# EAGLE design led-er-v3-module-e (EAGLE 7.2.0)
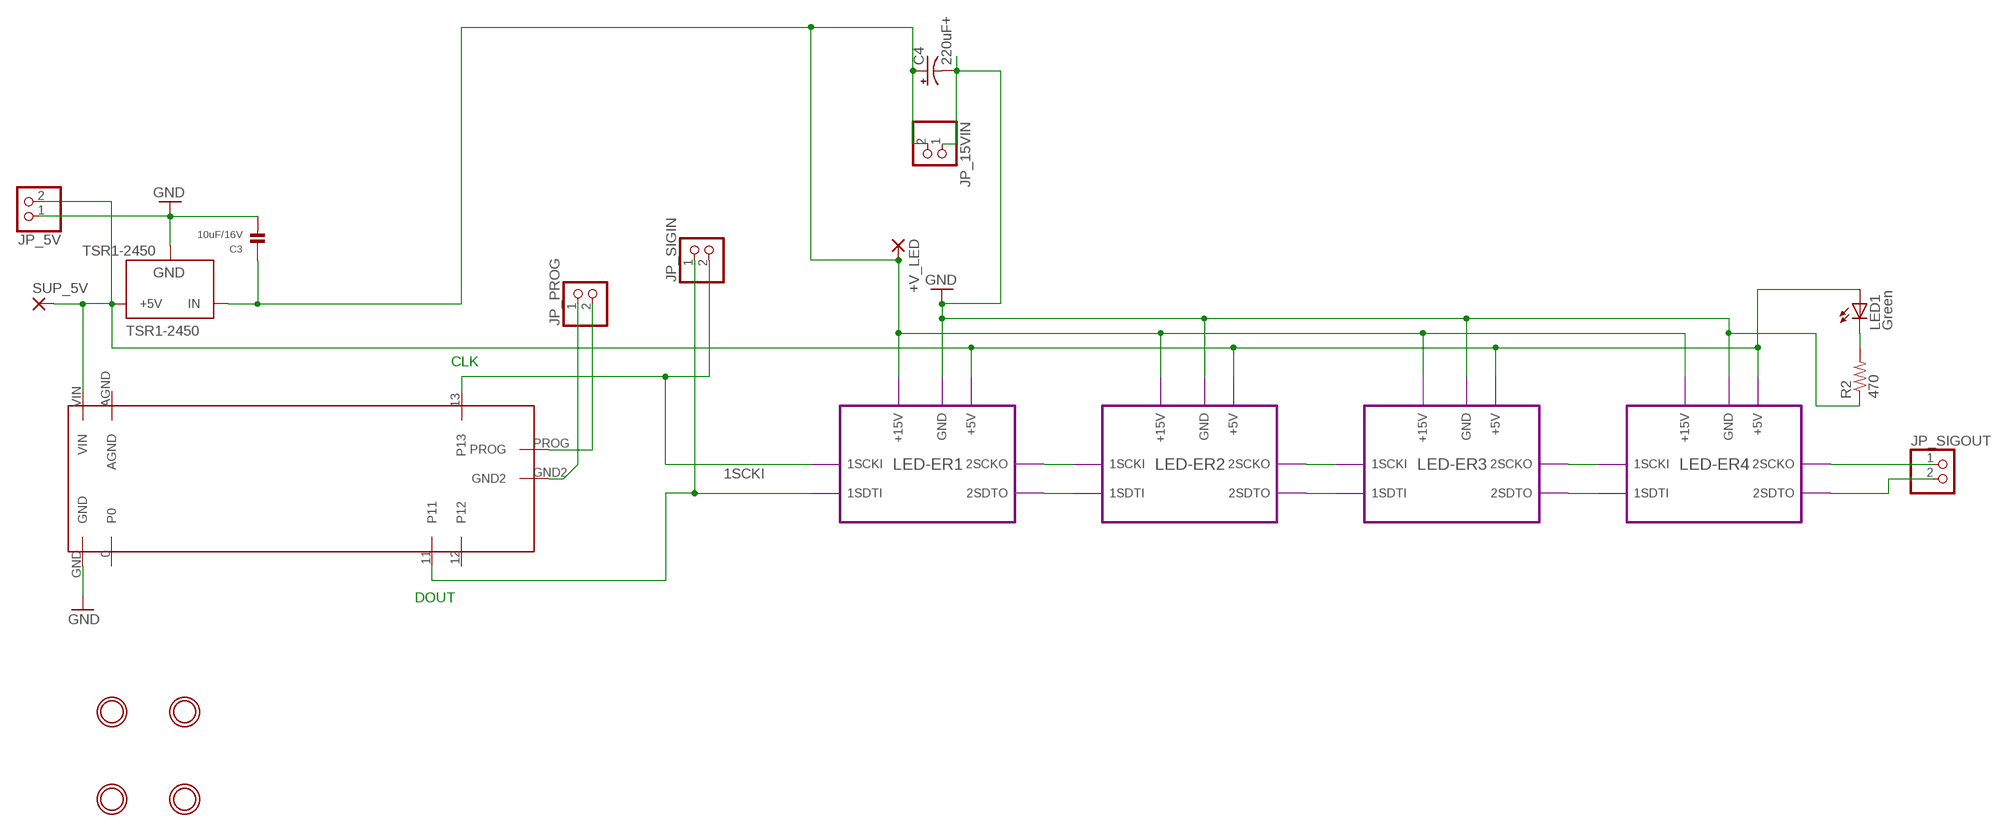
[diagram p0: schematic, sheet 1]

## Parts
+V_LED  3,17/1,1  [3,17/1,1]
C3  10uF/16V  CAP_CERAMIC0805  [0805]
C4  220uF+  CPOL-USE5-8.5  [E5-8,5]
JP_5V  HEADER-1X2  [1X02_OVAL]
JP_15VIN  HEADER-1X2  [1X02_OVAL]
JP_PROG  HEADER-1X2  [1X02_OVAL]
JP_SIGIN  HEADER-1X2  [1X02_OVAL]
JP_SIGOUT  HEADER-1X2  [1X02_OVAL]
LED1  Green  LED5MM  [LED5MM]
R2  470  RESISTOR_DUAL  [0805-THM]
SUP_5V  3,17/1,1  [3,17/1,1]
TSR1-2450  TSR1-2450  [TSR-1]
U$1  MOUNTINGHOLE  [MOUNTINGHOLE_3.0_PLATED]
U$2  MOUNTINGHOLE  [MOUNTINGHOLE_3.0_PLATED]
U$3  MOUNTINGHOLE  [MOUNTINGHOLE_3.0_PLATED]
U$4  MOUNTINGHOLE  [MOUNTINGHOLE_3.0_PLATED]
U$5  TEENSY_LEDER  [TEENSY_LEDER]

## Module instances
LED-ER1 = LED-ER
LED-ER2 = LED-ER
LED-ER3 = LED-ER
LED-ER4 = LED-ER

## Nets
1SCKI: JP_SIGIN.2 U$5.13 ; port LED-ER1.1SCKI
1SDTI: JP_SIGIN.1 U$5.11 ; port LED-ER1.1SDTI
+5V: JP_5V.2 LED1.A SUP_5V.1(P) TSR1-2450.3(+5V) U$5.VIN ; port LED-ER1.+5V LED-ER2.+5V LED-ER3.+5V LED-ER4.+5V
GND: C3.2 C4.- JP_5V.1 JP_15VIN.1 R2.1 TSR1-2450.2(GND) U$5.GND ; port LED-ER1.GND LED-ER2.GND LED-ER3.GND LED-ER4.GND
N$1: LED1.K(C) R2.2
N$2: port LED-ER1.2SCKO LED-ER2.1SCKI
N$3: port LED-ER1.2SDTO LED-ER2.1SDTI
N$4: port LED-ER2.2SCKO LED-ER3.1SCKI
N$5: port LED-ER2.2SDTO LED-ER3.1SDTI
N$6: port LED-ER3.2SCKO LED-ER4.1SCKI
N$7: port LED-ER3.2SDTO LED-ER4.1SDTI
N$8: JP_SIGOUT.1 ; port LED-ER4.2SCKO
N$9: JP_SIGOUT.2 ; port LED-ER4.2SDTO
N$54: JP_PROG.1 U$5.GND2
N$55: JP_PROG.2 U$5.PROG
VIN: +V_LED.1(P) C3.1 C4.+ JP_15VIN.2 TSR1-2450.1(IN) ; port LED-ER1.+15V LED-ER2.+15V LED-ER3.+15V LED-ER4.+15V
Unconnected: U$5.0 U$5.12 U$5.AGND

## Notes on the sheet
- CLK
- DOUT

## Library data of the parts
+V_LED SUP_5V = wirepad:3,17/1,1: THROUGH-HOLE PAD
C3 = microbuilder:CAP_CERAMIC: Ceramic Capacitors 0402 - 0402 Surface Mount Capacitors 16pF 50V 5% [Digikey: 445-4899-2-ND] 18pF 50V 5% [Digikey: 490-1281-2-ND] 22pF 50V 5% [Digikey: 490-1283-2-ND] 68pF 50V 5% [Digikey: 490-1289-2-ND] 0.1uF 10V 10% [Digikey: 490-1318-2-ND] 1.0uF 6.3V 10% [Digikey: 490-1320-2-ND] 0603 - 0603 Surface Mount Capacitors 16 pF 50V 5% [Digikey: 445-5051-2-ND] 22 pF 50V [Digikey: PCC220ACVTR-ND] 33 pF 50V 5% [Digikey: 490-1415-1-ND] 56pF 50V 5% [Digikey: 490-1421-1-ND] 220pF 50V 5% [Digikey: 445-1285-1-ND] 680 pF 50V 2200 pF 50V 5% C0G [Digikey: 445-1297-1-ND] 5600 pF 100V 5% X7R [Digikey: 478-3711-1-ND] 0.1 µF 25V 10% [Digikey: PCC2277TR-ND] 0.22 µF 16V 10% X7R [Digikey: 445-1318-1-ND] 1.0 µF 25V 10% [Digikey: 445-5146-2-ND] 0603 - RF Specific 3pF 250V +/-0.1pF RF [Digikey: 712-1347-1-ND] 18 pF 250V 5% [Digikey: 478-3505-1-ND or 712-1322-1-ND] 56 pF 250V 5% C0G RF [Digikey: 490-4867-1-ND] 68 pF 250V RF [Digikey: 490-4868-1-ND] 0805 - 0805 Surface Mount Capacitors 220 pF 250V 2% RF Ceramic Capacitor [Digikey: 712-1398-1-ND] 1000 pF 50V 2% NP0 Ceramic Capacitor [Digikey: 478-3760-1-ND] 0.1 µF 25V 10% Ceramic Capacitor [Digikey: PCC1828TR-ND] 1.0 µF 16V 10% Ceramic Capacitor[Digikey: 490-1691-2-ND] 10.0 µF 10V 10% Ceramic Capacitor[Digikey: 709-1228-1-ND] 10.0 uF 16V 10% Ceramic Capacitor [Digikey: 478-5165-2-ND] 47 uF 6.3V 20% Ceramic Capacitor [Digikey: 587-1779-1-ND or 399-5506-1-ND] 1206 - 1206 Surface Mount Capacitors 47uF 10V 20% Ceramic Capacitor [Digikey: 490-5528-1-ND or 399-5508-1-ND or 445-6010-1-ND] 100uF 6.3V -20%, +80% Y5V Ceramic Capacitor (Digikey: 490-4512-1-ND, Mouser: 81-GRM31CF50J107ZE1L)
C4 = adafruit:CPOL-US: POLARIZED CAPACITOR, American symbol
JP_5V JP_15VIN JP_PROG JP_SIGIN JP_SIGOUT = microbuilder:HEADER-1X2: PIN HEADER
LED1 = adafruit:LED: LED OSRAM: - CHIPLED LG R971, LG N971, LY N971, LG Q971, LY Q971, LO R971, LY R971 LH N974, LH R974 LS Q976, LO Q976, LY Q976 LO Q996 - Hyper CHIPLED LW Q18S LB Q993, LB Q99A, LB R99A - SideLED LS A670, LO A670, LY A670, LG A670, LP A670 LB A673, LV A673, LT A673, LW A673 LH A674 LY A675 LS A676, LA A676, LO A676, LY A676, LW A676 LS A679, LY A679, LG A679 - Hyper Micro SIDELED® LS Y876, LA Y876, LO Y876, LY Y876 LT Y87S - SmartLED LW L88C, LW L88S LB L89C, LB L89S, LG L890 LS L89K, LO L89K, LY L89K LS L896, LA L896, LO L896, LY L896 - TOPLED LS T670, LO T670, LY T670, LG T670, LP T670 LSG T670, LSP T670, LSY T670, LOP T670, LYG T670 LG T671, LOG T671, LSG T671 LB T673, LV T673, LT T673, LW T673 LH T674 LS T676, LA T676, LO T676, LY T676, LB T676, LH T676, LSB T676, LW T676 LB T67C, LV T67C, LT T67C, LS T67K, LO T67K, LY T67K, LW E67C LS E67B, LA E67B, LO E67B, LY E67B, LB E67C, LV E67C, LT E67C LW T67C LS T679, LY T679, LG T679 LS T770, LO T770, LY T770, LG T770, LP T770 LB T773, LV T773, LT T773, LW T773 LH T774 LS E675, LA E675, LY E675, LS T675 LS T776, LA T776, LO T776, LY T776, LB T776 LHGB T686 LT T68C, LB T68C - Hyper Mini TOPLED® LB M676 - Mini TOPLED Santana® LG M470 LS M47K, LO M47K, LY M47K Source: http://www.osram.convergy.de/
R2 = microbuilder:RESISTOR_DUAL: Flip Flop resistor An 0805 resistor inside a standard 1/4W 5% resistor. Makes for easy mods Footprint taken from the Adafruit Industries Eagle Library.
TSR1-2450 = SteelCaveRobotics-Power:TSR1-2450: Traco Power TSR 1-2450 5.0v switching regulator
U$1-U$4 = microbuilder:MOUNTINGHOLE: Mounting Hole For #2 screws (0.086"/2.18mm width, 0.094"/2.4mm hole) use 2.5mm
U$5 = Andrews:TEENSY_LEDER

## Module LED-ER
Ports: 1SCKI(io) 1SDTI(io) 2SCKO(io) 2SDTO(io) +15V(io) GND(io) +5V(io)
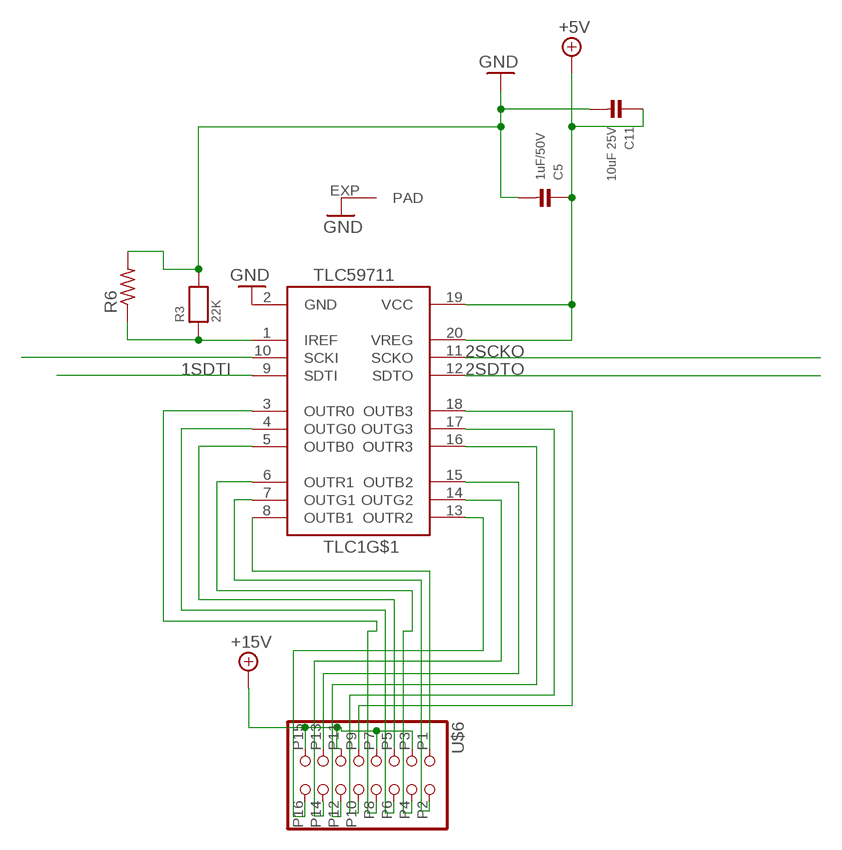
[diagram p1: schematic, module LED-ER, sheet 1]

### Parts
C5  1uF/50V  CAP_CERAMIC0805  [0805]
C11  10uF 25V  CAP_CERAMIC0805  [0805]
R3  22K  RESISTOR0805  [0805]
R6  R-US_0207/9  [0207/9]
TLC1  TLC59711  [HTSSOP20DAP]
U$6  HEADER-2X8-RIBBON  [2X08_RIBBON]

### Nets
1SCKI: TLC1.10(SCKI)
1SDTI: TLC1.9(SDTI)
2SCKO: TLC1.11(SCKO)
2SDTO: TLC1.12(SDTO)
+5V: C5.1 C11.1 TLC1.19(VCC) TLC1.20(VREG)
+15V: U$6.P3(P4) U$6.P7(P8) U$6.P11(P12) U$6.P15(P16)
B0: TLC1.5(OUTB0) U$6.P5(P6)
B1: TLC1.8(OUTB1) U$6.P1
B2: TLC1.15(OUTB2) U$6.P13(P14)
B3: TLC1.18(OUTB3) U$6.P9(P10)
G0: TLC1.4(OUTG0) U$6.P6(P5)
G1: TLC1.7(OUTG1) U$6.P2
G2: TLC1.14(OUTG2) U$6.P14(P13)
G3: TLC1.17(OUTG3) U$6.P10(P9)
GND: C5.2 C11.2 R3.2 R6.2 TLC1.2(GND) TLC1.EXP(PAD)
IREF: R3.1 R6.1 TLC1.1(IREF)
R0: TLC1.3(OUTR0) U$6.P8(P7)
R1: TLC1.6(OUTR1) U$6.P4(P3)
R2: TLC1.13(OUTR2) U$6.P16(P15)
R3: TLC1.16(OUTR3) U$6.P12(P11)

### Library data of the parts
C5 C11 = microbuilder:CAP_CERAMIC: Ceramic Capacitors 0402 - 0402 Surface Mount Capacitors 16pF 50V 5% [Digikey: 445-4899-2-ND] 18pF 50V 5% [Digikey: 490-1281-2-ND] 22pF 50V 5% [Digikey: 490-1283-2-ND] 68pF 50V 5% [Digikey: 490-1289-2-ND] 0.1uF 10V 10% [Digikey: 490-1318-2-ND] 1.0uF 6.3V 10% [Digikey: 490-1320-2-ND] 0603 - 0603 Surface Mount Capacitors 16 pF 50V 5% [Digikey: 445-5051-2-ND] 22 pF 50V [Digikey: PCC220ACVTR-ND] 33 pF 50V 5% [Digikey: 490-1415-1-ND] 56pF 50V 5% [Digikey: 490-1421-1-ND] 220pF 50V 5% [Digikey: 445-1285-1-ND] 680 pF 50V 2200 pF 50V 5% C0G [Digikey: 445-1297-1-ND] 5600 pF 100V 5% X7R [Digikey: 478-3711-1-ND] 0.1 µF 25V 10% [Digikey: PCC2277TR-ND] 0.22 µF 16V 10% X7R [Digikey: 445-1318-1-ND] 1.0 µF 25V 10% [Digikey: 445-5146-2-ND] 0603 - RF Specific 3pF 250V +/-0.1pF RF [Digikey: 712-1347-1-ND] 18 pF 250V 5% [Digikey: 478-3505-1-ND or 712-1322-1-ND] 56 pF 250V 5% C0G RF [Digikey: 490-4867-1-ND] 68 pF 250V RF [Digikey: 490-4868-1-ND] 0805 - 0805 Surface Mount Capacitors 220 pF 250V 2% RF Ceramic Capacitor [Digikey: 712-1398-1-ND] 1000 pF 50V 2% NP0 Ceramic Capacitor [Digikey: 478-3760-1-ND] 0.1 µF 25V 10% Ceramic Capacitor [Digikey: PCC1828TR-ND] 1.0 µF 16V 10% Ceramic Capacitor[Digikey: 490-1691-2-ND] 10.0 µF 10V 10% Ceramic Capacitor[Digikey: 709-1228-1-ND] 10.0 uF 16V 10% Ceramic Capacitor [Digikey: 478-5165-2-ND] 47 uF 6.3V 20% Ceramic Capacitor [Digikey: 587-1779-1-ND or 399-5506-1-ND] 1206 - 1206 Surface Mount Capacitors 47uF 10V 20% Ceramic Capacitor [Digikey: 490-5528-1-ND or 399-5508-1-ND or 445-6010-1-ND] 100uF 6.3V -20%, +80% Y5V Ceramic Capacitor (Digikey: 490-4512-1-ND, Mouser: 81-GRM31CF50J107ZE1L)
R3 = microbuilder:RESISTOR: Resistors 0402 - 0402 Surface Mount Package 22 Ohm 1% 1/16W [Digikey: 311-22.0LRTR-ND] 33 Ohm 5% 1/16W 1.0K 5% 1/16W 1.5K 5% 1/16W 2.0K 1% 1/16W 10.0K 1% 1/16W [Digikey: 311-10.0KLRTR-ND] 10.0K 5% 1/16W [Digikey: RMCF0402JT10K0TR-ND] 12.1K 1% 1/16W [Digikey: 311-22.0LRTR-ND] 100.0K 5% 1/16W 0603 - 0603 Surface Mount Package 0 Ohm 1/10 Watt 1% Resistor 15 Ohm 1/10 Watt 1% Resistor 33 Ohm 1/10 Watt 1% Resistor 49.9 Ohm 1/10 Watt 1% Resistor 100 Ohm 1/10 Watt 1% Resistor 150 Ohm 1/10 Watt 1% Resistor 240 Ohm 1/10 Watt 1% Resistor 390 Ohm 1/10 Watt 1% Resistor 560 Ohm 1/10 Watt 1% Resistor 680 Ohm 1/10 Watt 1% Resistor 750 Ohm 1/10 Watt 1% Resistor 1.0K Ohm 1/10 Watt 1% Resistor 1.5K Ohm 1/10 Watt 1% Resistor 2.0K Ohm 1/10 Watt 1% Resistor 2.2K Ohm 1/10 Watt 1% Resistor 3.3K Ohm 1/10 Watt 1% Resistor 4.7K Ohm 1/10 Watt 1% Resistor 10.0K Ohm 1/10 Watt 1% Resistor 12.0K Ohm 1/10 Watt 1% Resistor 12.1K Ohm 1/10 Watt 1% Resistor 20.0K Ohm 1/10 Watt 1% Resistor 33.0K Ohm 1/10 Watt 1% Resistor 100.0K Ohm 1/10 Watt 1% Resistor 0805 - 0805 Surface Mount Package 0 Ohm 1/8 Watt 1% Resistor 33 Ohm 1/8 Watt 1% Resistor 100 Ohm 1/8 Watt 1% Resistor 150 Ohm 1/8 Watt 1% Resistor 200 Ohm 1/8 Watt 1% Resistor 240 Ohm 1/8 Watt 1% Resistor 330 Ohm 1/8 Watt 1% Resistor 390 Ohm 1/8 Watt 1% Resistor 470 Ohm 1/8 Watt 1% Resistor 1.0K Ohm 1/8 Watt 1% Resistor 1.5K Ohm 1/8 Watt 1% Resistor 2.0K Ohm 1/8 Watt 1% Resistor 4.7K Ohm 1/8 Watt 1% Resistor 5.1K Ohm 1/8 Watt 1% Resistor 5.6K Ohm 1/8 Watt 1% Resistor 10.0K Ohm 1/8 Watt 1% Resistor 22.0K Ohm 1/8 Watt 1% Resistor 33.0K Ohm 1/8 Watt 1% Resistor 100K Ohm 1/8 Watt 1% Resistor 1206 - 1206 Surface Mount Package 2012 - 2010 Surface Mount Package 0.11 Ohm 1/2 Watt 1% Resistor - Digikey: RHM.11UCT-ND
R6 = adafruit:R-US_: RESISTOR, American symbol
TLC1 = adafruit:TLC59711
U$6 = Andrews:HEADER-2X8-RIBBON

## Board
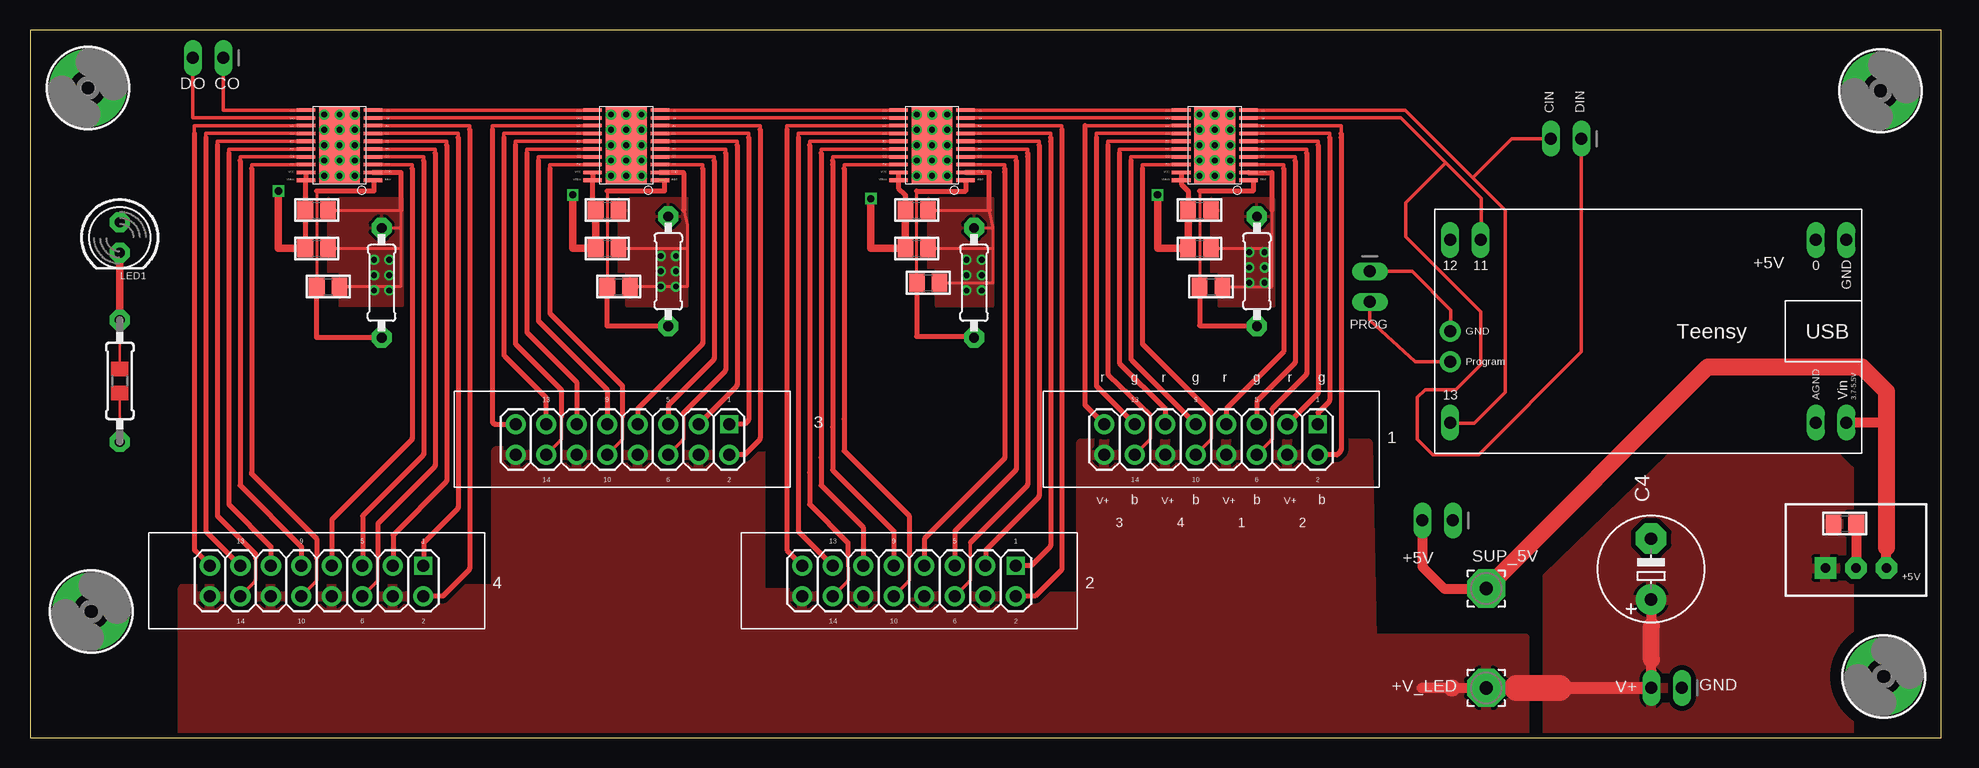
[diagram p2: board, top side]
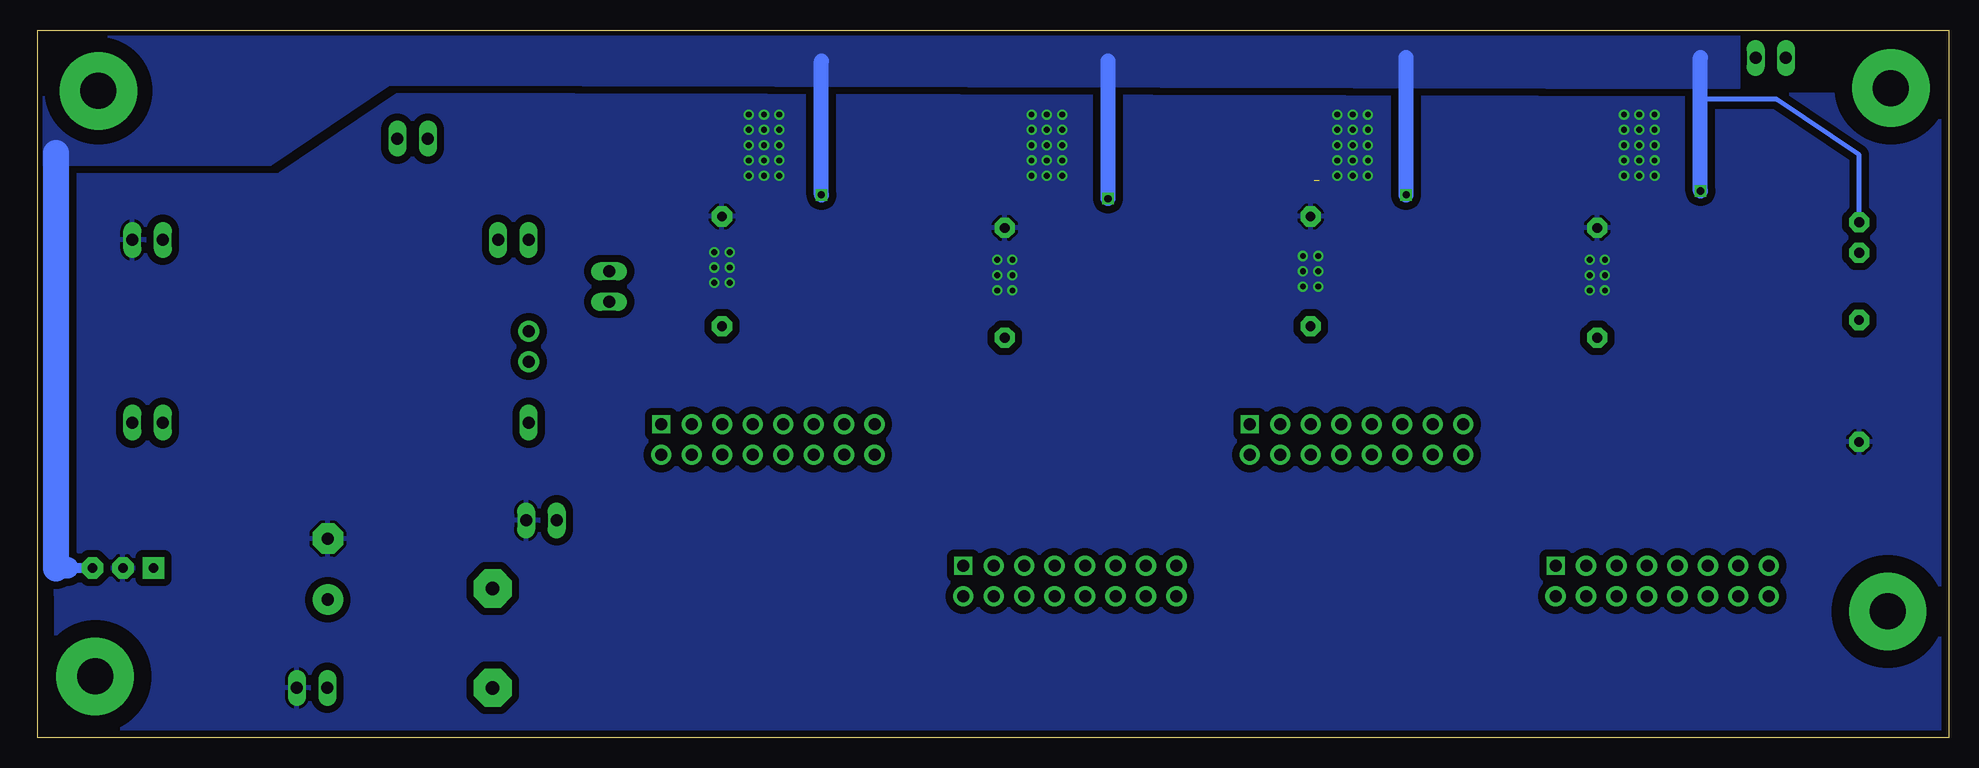
[diagram p3: board, bottom side, seen from below]

Size 159.28 x 58.97 mm. Coordinates in mm from the lower left corner, seen from the top.
Outline: 159.28,0 159.28,58.97 0,58.97 0,0 159.26,0
Copper layers (1*16): Top 0.0356mm / dielectric 1.5011mm / Bottom 0.0356mm
Design rules "LaenPCBOrder": minimum track width 6mil, minimum drill 13mil, track to track 6mil, track to pad 6mil, pad to pad 6mil, via to via 6mil, smd to smd 6mil, copper to edge 15mil, drill to drill 6mil, minimum pad ring 7mil, minimum via ring 7mil, stop-mask expansion 3mil, vias tented up to drill 0mil, thermal gap 10mil
tRestrict: area 72.9,12.1 to 73.6,13.1

### Footprints (pad centres in the part's own frame; a part is rotated, then mirrored left to right if it is on the bottom)
3,17/1,1 = drill 1.118 pad 3.175 octagon: 1 0,0
0805 = smd 1.3 x 1.5: 1 -0.95,0; 2 0.95,0
E5-8,5 = drill 1.016 pad 2.54: + -2.54,0 | drill 1.016 pad 2.54 octagon: - 2.54,0
1X02_OVAL = drill 1 long: 1 -1.27,0; 2 1.27,0
LED5MM = drill 0.813 pad 1.676 octagon: A -1.27,0; K 1.27,0
0207/9 = drill 0.813 pad 1.676 octagon: 1 -4.572,0; 2 4.572,0
HTSSOP20DAP = smd 0.3 x 1.55: 1 -2.925,-2.8; 2 -2.275,-2.8; 3 -1.625,-2.8; 4 -0.975,-2.8; 5 -0.325,-2.8; 6 0.325,-2.8; 7 0.975,-2.8; 8 1.625,-2.8; 9 2.275,-2.8; 10 2.925,-2.8; 11 2.925,2.8; 12 2.275,2.8; 13 1.625,2.8; 14 0.975,2.8; 15 0.325,2.8; 16 -0.325,2.8; 17 -0.975,2.8; 18 -1.625,2.8; 19 -2.275,2.8; 20 -2.925,2.8 | smd 6.5 x 3.4: EXP 0,0
2X08_RIBBON = drill 1 pad 1.676: P1 -8.89,1.27; P3 -6.35,1.27; P4 -6.35,-1.27; P5 -3.81,1.27; P6 -3.81,-1.27; P7 -1.27,1.27; P8 -1.27,-1.27; P9 1.27,1.27; P10 1.27,-1.27; P11 3.81,1.27; P12 3.81,-1.27; P13 6.35,1.27; P14 6.35,-1.27; P15 8.89,1.27; P16 8.89,-1.27 | drill 1 square: P2 -8.89,-1.27
0805-THM = drill 0.813 pad 1.676 octagon: 1 -5.08,0; 2 5.08,0
TSR-1 = drill 0.8 pad 1.8 square: 1 -2.54,-1.5 | drill 0.8 pad 1.8 octagon: 2 0,-1.5; 3 2.54,-1.5
MOUNTINGHOLE_3.0_PLATED = drill 3 pad 6.452: P$1 0,0
TEENSY_LEDER = drill 1 pad 1.422 long: 0 12.7,7.62; 11 -15.24,7.62; 12 -17.78,7.62; 13 -17.78,-7.62; AGND 12.7,-7.62; GND 15.24,7.62; VIN 15.24,-7.62 | drill 1 pad 1.778: GND2 -17.78,0; PROG -17.78,-2.54

### Placement (x,y rotation side)
+V_LED  121.35,4.14 0 top
C3  151.24,17.84 0 top
C4  135.09,14.04 90 top
JP_5V  117.3,18.09 180 top
JP_15VIN  136.39,4.15 180 top
JP_PROG  111.65,37.57 270 top
JP_SIGIN  128.02,49.91 180 top
JP_SIGOUT  14.85,56.65 180 top
LED1  7.48,41.67 270 top
LED-ER1:C5  1uF/50V  [0805]  97.47,43.96 0 top
LED-ER1:C11  10uF 25V  [0805]  97.47,40.77 0 top
LED-ER1:R3  22K  [0805]  98.42,37.58 0 top
LED-ER1:R6  [0207/9]  102.24,38.86 90 top
LED-ER1:TLC1  TLC59711  [HTSSOP20DAP]  98.74,49.37 90 top
LED-ER1:U$6  HEADER-2X8-RIBBON  [2X08_RIBBON]  98.42,24.84 180 top
LED-ER2:C5  1uF/50V  [0805]  73.9,43.96 0 top
LED-ER2:C11  10uF 25V  [0805]  73.9,40.77 0 top
LED-ER2:R3  22K  [0805]  74.85,37.9 0 top
LED-ER2:R6  [0207/9]  78.67,37.9 90 top
LED-ER2:TLC1  TLC59711  [HTSSOP20DAP]  75.17,49.37 90 top
LED-ER2:U$6  HEADER-2X8-RIBBON  [2X08_RIBBON]  73.26,13.06 180 top
LED-ER3:C5  1uF/50V  [0805]  48.1,40.77 0 top
LED-ER3:C11  10uF 25V  [0805]  48.1,43.96 0 top
LED-ER3:R3  22K  [0805]  49.05,37.58 0 top
LED-ER3:R6  [0207/9]  53.19,38.86 90 top
LED-ER3:TLC1  TLC59711  [HTSSOP20DAP]  49.69,49.37 90 top
LED-ER3:U$6  HEADER-2X8-RIBBON  [2X08_RIBBON]  49.37,24.84 180 top
LED-ER4:C5  1uF/50V  [0805]  23.89,40.77 0 top
LED-ER4:C11  10uF 25V  [0805]  23.89,43.96 0 top
LED-ER4:R3  22K  [0805]  24.84,37.58 0 top
LED-ER4:R6  [0207/9]  29.3,37.9 90 top
LED-ER4:TLC1  TLC59711  [HTSSOP20DAP]  25.8,49.37 90 top
LED-ER4:U$6  HEADER-2X8-RIBBON  [2X08_RIBBON]  23.89,13.06 180 top
R2  7.48,29.72 90 top
SUP_5V  121.35,12.42 0 top
TSR1-2450  152.16,15.63 0 top
U$1  154.21,53.9 0 top
U$2  5.1,10.51 0 top
U$3  4.83,54.13 0 top
U$4  154.48,5.1 0 top
U$5  136.13,33.86 0 top

### Tracks (layer width: path | path; a pad name or v marks a point on that pad's centre or on a via)
1SCKI
  Top 0.305: LED-ER1:TLC1.10 114.61,52.3 120.24,46.66 | 120.24,46.66 122.95,43.95 122.95,28.79 120.37,26.21 118.38,26.21 U$5.13 | JP_SIGIN.2 123.48,49.91 120.24,46.66
1SDTI
  Top 0.305: LED-ER1:TLC1.9 114.24,51.65 117.98,47.91 | 117.98,47.91 120.92,44.96 120.92,41.52 U$5.11 | JP_SIGIN.1 129.29,32.14 120.72,23.57 116.89,23.57 115.62,24.84 115.62,28.35 116.26,28.98 118.82,28.98 120.9,31.06 120.9,35.49 114.67,41.73 114.67,44.59 117.98,47.91
+5V  (via drill 0.6)
  Top 0.254: LED-ER1:TLC1.20 | LED-ER3:TLC1.20 47.15,46.45 | LED-ER4:TLC1.20 22.94,46.45 | LED-ER2:C5.1 | LED-ER3:C11.1
  Top 0.305: LED-ER1:C5.1 | LED-ER2:C5.1 | LED-ER4:TLC1.19 23,46.96 | LED-ER3:TLC1.19 46.89,46.98 | LED-ER2:TLC1.19 | LED-ER2:TLC1.19 72.37,46.99 | LED-ER1:TLC1.19 | LED-ER1:TLC1.19 95.94,47
  Top 0.406: LED-ER4:C5.1 LED-ER4:C11.1 23,43.95 LED-ER4:TLC1.20 23,46.96 | LED-ER1:C5.1 96.51,45.55 95.94,46.12 LED-ER1:TLC1.20 95.94,47 | LED-ER2:C5.1 72.94,45.23 72.37,45.8 LED-ER2:TLC1.20 72.37,46.99 | LED-ER3:C11.1 46.89,43.95 LED-ER3:TLC1.20 46.89,46.98 | 72.37,46.99 | 95.94,47 | LED-ER1:C11.1 | LED-ER2:C11.1
  Top 0.61: v93.96,45.23 93.96,40.77 LED-ER1:C11.1 LED-ER1:C5.1 | v70.07,44.91 70.07,40.77 LED-ER2:C11.1 LED-ER2:C5.1 | LED-ER3:C11.1 LED-ER3:C5.1 45.23,40.77 v45.23,45.23 | LED-ER4:C5.1 20.7,40.77 v20.7,45.55
  Top 0.813: TSR1-2450.3 154.7,15.85 154.7,26.25 U$5.VIN | JP_5V.2 116.03,14.35 arc45 116.11,14.17 117.85,12.42 SUP_5V.1 | SUP_5V.1 arc-45 SUP_5V.1
  Top 1.422: SUP_5V.1 arc-37 SUP_5V.1 | SUP_5V.1 139.83,30.9 152.55,30.9 arc-45 152.73,30.82 154.69,28.86 154.69,15.87 arc45 154.7,15.85
  Bottom 0.406: LED1.A 7.48,48.57 14.33,53.19 20.7,53.19
  Bottom 0.813: TSR1-2450.3 156.37,14.13 156.77,14.14
  Bottom 1.27: v93.96,45.23 93.96,56.38 | v70.07,44.91 70.07,56.38 | v45.23,45.23 45.23,56.7 | v20.7,45.55 20.7,53.19 20.7,56.7
  Bottom 1.778: 156.77,14.14 157.72,14.11
  Bottom 2.184: 157.72,14.11 157.72,48.71
  pour Bottom (isolate 0.406): 17.52,54.15 129.95,54.47 139.83,47.78 159.26,47.78 159.26,59.56 17.52,59.24
GND  (via drill 0.48)  (3 unrouted)
  Top 0.254: LED-ER1:TLC1.2 | LED-ER1:R3.2 103.51,37.59 103.51,40.77 | 103.51,40.77 103.51,43.95 | LED-ER2:C5.2 | LED-ER2:R3.2 80.27,37.9 80.27,40.77 | 80.27,40.77 80.27,42.48 | 80.27,42.48 79.95,43.95 LED-ER2:C5.2 | LED-ER2:R6.2 80.27,42.48 | 54.47,43.95 54.78,42.79 54.78,40.77 | 54.78,40.77 54.78,37.59 v53.83,37.59 v52.55,37.59 LED-ER3:R3.2 | LED-ER3:R3.2 | 30.9,42.48 30.9,43.95 LED-ER4:C11.2 | 30.9,42.48 30.9,40.77 | 30.9,40.77 30.9,37.59 LED-ER4:R3.2 | LED-ER4:R6.2 30.9,42.48 | LED-ER4:C5.2 30.9,40.77 | LED-ER3:C5.2 54.78,40.77 | LED-ER2:C11.2 80.27,40.77 | LED-ER1:C11.2 103.51,40.77
  Top 0.305: 30.9,47.09 30.89,47.04 | 54.47,47.09 54.47,47.04 | 103.51,47.09 103.51,47.03
  Top 0.406: 103.51,43.95 103.51,47.03 | 79.95,43.95 79.95,47.09 LED-ER2:TLC1.2 | 54.47,47.04 54.47,43.95 | 30.89,47.04 30.9,43.95 | LED-ER4:TLC1.2 30.9,47.09 | LED-ER3:TLC1.2 54.47,47.09 | LED-ER1:TLC1.2 103.51,47.09
  Top 0.813: C3.2 152.19,14.13 TSR1-2450.2
  other vias: 24.53,51.92 25.8,51.92 27.07,51.92 24.53,50.64 25.8,50.64 24.53,49.37 25.8,49.37 27.07,49.37 24.53,48.1 25.8,48.1 27.07,48.1 24.53,46.82 25.8,46.82 27.07,46.82 27.07,50.64 97.47,51.92 98.74,51.92 100.01,51.92 97.47,50.64 98.74,50.64 100.01,50.64 97.47,49.37 98.74,49.37 100.01,49.37 97.47,48.1 98.74,48.1 100.01,48.1 97.47,46.82 98.74,46.82 100.01,46.82 73.9,51.92 75.17,51.92 76.44,51.92 73.9,50.64 75.17,50.64 76.44,50.64 73.9,49.37 75.17,49.37 76.44,49.37 73.9,48.1 75.17,48.1 76.44,48.1 73.9,46.82 75.17,46.82 76.44,46.82 48.41,51.92 49.69,51.92 50.96,51.92 48.41,50.64 49.69,50.64 48.41,49.37 49.69,49.37 50.96,49.37 48.41,48.1 49.69,48.1 50.96,48.1 48.41,46.82 49.69,46.82 50.96,46.82 50.96,50.64 28.67,39.81 28.67,38.54 29.94,38.54 28.67,37.27 29.94,37.27 29.94,39.81 52.56,40.13 53.83,40.13 52.56,38.86 53.83,38.86 78.04,39.81 78.04,38.54 78.04,37.27 79.31,37.27 79.31,38.54 79.31,39.81 101.61,40.45 102.88,40.45 101.61,39.18 102.88,39.18 101.61,37.9 102.88,37.9
  pour Top: 98.42,44.91 98.42,38.86 99.06,38.86 99.06,35.99 103.68,35.97 103.68,44.89
  pour Top: 74.85,44.91 74.85,39.18 75.49,39.18 75.49,35.99 80.27,35.99 80.27,44.91
  pour Top: 49.05,38.86 49.69,38.86 49.69,35.99 54.78,35.99 54.78,44.91 49.05,44.91
  pour Top: 24.84,44.91 24.84,38.86 25.8,38.86 25.8,35.99 31.05,36.02 31.05,44.94
  pour Bottom (isolate 0.61, rank 2): 0.32,53.51 157.98,53.83 157.67,0.32 0,0
LED-ER1:B0
  Top 0.305: LED-ER1:TLC1.5 106.38,49.05 106.38,48.73 | 103.52,27.39 103.52,24.97 arc-45 103.44,24.79 LED-ER1:U$6.P5
  Top 0.406: 106.38,48.73 106.38,30.36 arc-45 106.31,30.18 103.52,27.39
LED-ER1:B1
  Top 0.305: LED-ER1:TLC1.8 109.25,50.99 109.25,50.01
  Top 0.406: 109.25,50.36 109.25,50.01 109.25,23.99 arc-45 109.18,23.81 108.93,23.57 LED-ER1:U$6.P1 arc-45 LED-ER1:U$6.P1
LED-ER1:B2
  Top 0.305: LED-ER1:TLC1.15 89.82,49.7 89.82,49.38 | 93.35,26.93 93.35,24.95 arc-45 93.27,24.78 LED-ER1:U$6.P13
  Top 0.406: 89.82,49.38 89.82,30.36 arc45 89.9,30.18 93.35,26.93
LED-ER1:B3
  Top 0.305: LED-ER1:TLC1.18 92.69,47.74 92.69,47.43 | 98.42,27.07 98.42,24.95 arc-45 98.35,24.77 LED-ER1:U$6.P9
  Top 0.406: 92.69,47.43 92.69,32.91 arc45 92.76,32.73 98.42,27.07
LED-ER1:G0
  Top 0.305: LED-ER1:TLC1.4 105.43,48.4 105.43,48.08
  Top 0.406: 105.43,48.08 105.43,31.32 arc-45 105.35,31.14 102.24,28.03 102.24,26.14 arc-45 LED-ER1:U$6.P6
LED-ER1:G1
  Top 0.305: LED-ER1:TLC1.7 108.3,50.34 108.3,50.03
  Top 0.406: 108.3,50.03 108.3,28.14 arc-45 108.22,27.95 107.34,27.07 107.34,26.18 arc-45 LED-ER1:U$6.P2
LED-ER1:G2
  Top 0.305: LED-ER1:TLC1.14 88.87,50.34 88.87,50.03
  Top 0.406: 88.87,50.03 88.87,29.3 90.78,27.39 arc-45 90.81,27.38 LED-ER1:U$6.P14
LED-ER1:G3
  Top 0.305: LED-ER1:TLC1.17 91.73,48.4 91.73,48.08
  Top 0.406: 91.73,48.08 91.73,31.64 arc45 91.81,31.46 LED-ER1:U$6.P10
LED-ER1:IREF
  Top 0.254: LED-ER1:TLC1.1 101.92,46.45 | 97.47,45.55 LED-ER1:R3.1 | 102.24,34.33 LED-ER1:R6.1
  Top 0.305: 101.92,46.45 101.92,46.33
  Top 0.406: 97.47,45.55 101.92,45.55 101.92,46.33 | LED-ER1:R3.1 97.47,34.33 102.24,34.33
LED-ER1:R0
  Top 0.305: LED-ER1:TLC1.3 104.47,47.74 104.47,47.43
  Top 0.406: 104.47,47.43 104.47,32.17 99.7,27.39 99.7,26.12 arc-45 LED-ER1:U$6.P8
LED-ER1:R1
  Top 0.305: LED-ER1:TLC1.6 107.34,49.7 107.34,49.38
  Top 0.406: 107.34,49.38 107.34,28.79 arc-45 107.27,28.61 LED-ER1:U$6.P4
LED-ER1:R2
  Top 0.305: LED-ER1:TLC1.13 87.91,50.99
  Top 0.406: 87.91,50.99 87.91,27.73 LED-ER1:U$6.P16
LED-ER1:R3
  Top 0.305: LED-ER1:TLC1.16 90.78,49.05 90.78,48.73
  Top 0.406: 90.78,48.73 90.78,31.21 94.6,27.39 94.6,26.14 arc45 LED-ER1:U$6.P12
LED-ER2:B0
  Top 0.305: LED-ER2:TLC1.5 83.13,49.05 83.13,48.41 | 78.36,16.24 78.36,13.18 arc-45 78.28,13 LED-ER2:U$6.P5
  Top 0.406: 83.13,48.73 83.13,48.41 83.13,21.13 arc-45 83.06,20.95 78.36,16.24
LED-ER2:B1
  Top 0.305: LED-ER2:TLC1.8 86,50.99 86,50.68
  Top 0.406: 86,50.68 86,14.12 arc-45 85.92,13.94 83.77,11.79 LED-ER2:U$6.P1 arc-45 LED-ER2:U$6.P1
LED-ER2:B2
  Top 0.305: LED-ER2:TLC1.15 64.98,49.7 64.98,49.38 | 68.16,15.29 68.17,13.17 arc-45 68.09,12.97 LED-ER2:U$6.P13
  Top 0.406: 64.98,49.38 64.98,22.08 64.98,19.43 68.16,16.24 68.16,15.29
LED-ER2:B3
  Top 0.305: LED-ER2:TLC1.18 67.84,47.74 67.84,47.43 | 73.26,15.29 73.26,13.16 arc-45 73.18,12.98 LED-ER2:U$6.P9
  Top 0.406: 67.84,47.43 67.84,26.54 67.84,23.89 73.26,18.47 73.26,15.29
LED-ER2:G0
  Top 0.305: LED-ER2:TLC1.4 82.18,48.4 82.18,48.1
  Top 0.406: 82.18,48.1 82.18,22.4 arc-45 82.1,22.22 77.08,17.2 77.08,14.36 arc-45 LED-ER2:U$6.P6
LED-ER2:G1
  Top 0.305: LED-ER2:TLC1.7 85.04,50.34 85.04,49.69
  Top 0.406: 85.04,50.03 85.04,49.69 85.04,16.03 arc-45 84.97,15.85 83.45,14.33 LED-ER2:U$6.P2 arc45 LED-ER2:U$6.P2
LED-ER2:G2
  Top 0.305: LED-ER2:TLC1.14 64.02,50.34 64.02,49.69
  Top 0.406: 64.02,50.03 64.02,49.69 64.02,21.13 64.02,17.22 LED-ER2:U$6.P14
LED-ER2:G3
  Top 0.305: LED-ER2:TLC1.17 66.89,48.4 66.89,47.78
  Top 0.406: 66.89,48.08 66.89,47.78 66.89,25.91 66.89,22.3 71.98,17.2 LED-ER2:U$6.P10
LED-ER2:IREF
  Top 0.254: 73.9,45.55 LED-ER2:R3.1 | 78.67,33.44 LED-ER2:R6.1
  Top 0.305: LED-ER2:TLC1.1 77.97,46.3
  Top 0.406: 73.9,45.55 77.97,45.55 77.97,46.3 | LED-ER2:R3.1 73.9,33.44 78.67,33.44
LED-ER2:R0
  Top 0.305: LED-ER2:TLC1.3 81.22,47.74 81.22,47.14
  Top 0.406: 81.22,47.43 81.22,47.14 81.22,23.36 arc-45 81.15,23.18 74.53,16.56 LED-ER2:U$6.P8 arc-45 LED-ER2:U$6.P8
LED-ER2:R1
  Top 0.305: LED-ER2:TLC1.6 84.09,49.7 84.09,49.38
  Top 0.406: 84.09,49.38 84.09,20.17 arc-45 84.01,19.99 79.63,15.61 79.63,14.38 arc-45 LED-ER2:U$6.P4
LED-ER2:R2
  Top 0.305: LED-ER2:TLC1.13 63.07,50.99 63.07,50.68
  Top 0.406: 63.07,50.68 63.07,20.17 63.07,15.63 LED-ER2:U$6.P16
LED-ER2:R3
  Top 0.305: LED-ER2:TLC1.16 65.93,49.05 65.93,48.73
  Top 0.406: 65.93,48.73 65.93,23.36 65.93,21.02 69.44,17.52 69.44,14.34 LED-ER2:U$6.P12
LED-ER3:B0
  Top 0.305: LED-ER3:TLC1.5 57.97,49.05 57.97,48.73 | 54.47,27.07 54.47,24.97 arc-45 54.39,24.79 LED-ER3:U$6.P5
  Top 0.406: 57.97,48.73 57.97,30.68 arc-45 57.9,30.5 54.47,27.07
LED-ER3:B1
  Top 0.305: LED-ER3:TLC1.8 60.84,50.99 60.84,50.68
  Top 0.406: 60.84,50.68 60.84,24.95 arc-45 60.76,24.77 59.56,23.57 LED-ER3:U$6.P1 arc-45 LED-ER3:U$6.P1
LED-ER3:B2
  Top 0.305: LED-ER3:TLC1.15 40.45,49.7 40.45,49.38 | 44.27,26.75 44.27,24.93 arc-45 44.2,24.75 LED-ER3:U$6.P13
  Top 0.406: 40.45,49.38 40.45,32.91 arc45 40.53,32.73 44.27,28.98 44.27,26.75
LED-ER3:B3
  Top 0.305: LED-ER3:TLC1.18 43.32,47.74 43.32,47.43 | 49.37,26.75 49.37,24.95 arc-45 49.3,24.77 LED-ER3:U$6.P9
  Top 0.406: 43.32,47.43 43.32,35.46 arc45 43.39,35.28 49.37,29.3 49.37,26.75
LED-ER3:G0
  Top 0.305: LED-ER3:TLC1.4 57.01,48.4 57.01,48.08
  Top 0.406: 57.01,48.08 57.01,31.64 arc-45 56.94,31.46 53.19,27.71 53.19,26.14 arc-45 LED-ER3:U$6.P6
LED-ER3:G1
  Top 0.305: LED-ER3:TLC1.7 59.88,50.34 59.88,50.03
  Top 0.406: 59.88,50.03 59.88,26.54 arc-45 59.81,26.36 59.56,26.12 LED-ER3:U$6.P2 arc45 LED-ER3:U$6.P2
LED-ER3:G2
  Top 0.305: LED-ER3:TLC1.14 39.5,50.34 39.5,50.03
  Top 0.406: 39.5,50.03 39.5,31.96 arc45 39.57,31.78 43,28.35 43,26.16 arc45 LED-ER3:U$6.P14
LED-ER3:G3
  Top 0.305: LED-ER3:TLC1.17 42.36,48.4 42.36,48.08
  Top 0.406: 42.36,48.08 42.36,34.82 arc45 42.44,34.64 48.1,28.98 48.1,26.12 arc45 LED-ER3:U$6.P10
LED-ER3:IREF  (1 unrouted)
  Top 0.254: 48.1,45.55 LED-ER3:R3.1
  Top 0.305: 52.87,46.45 52.88,46.45 52.88,46.26
  Top 0.406: 48.1,45.55 52.87,45.55 52.87,46.26 52.88,46.26 | LED-ER3:R6.1 48.1,34.29 LED-ER3:R3.1
LED-ER3:R0
  Top 0.305: LED-ER3:TLC1.3 56.06,47.74 56.06,47.43
  Top 0.406: 56.06,47.43 56.06,32.91 arc-45 55.98,32.73 50.64,27.39 50.64,26.12 arc-45 LED-ER3:U$6.P8
LED-ER3:R1
  Top 0.305: LED-ER3:TLC1.6 58.92,49.7 58.92,49.38
  Top 0.406: 58.92,49.38 58.92,29.43 arc-45 58.85,29.25 LED-ER3:U$6.P4
LED-ER3:R2
  Top 0.305: LED-ER3:TLC1.13 38.54,50.99 38.54,50.68
  Top 0.406: 38.54,50.68 38.54,26.37 arc90 38.79,26.11 LED-ER3:U$6.P16
LED-ER3:R3
  Top 0.305: LED-ER3:TLC1.16 41.41,49.05 41.41,48.73
  Top 0.406: 41.41,48.73 41.41,33.87 arc45 41.48,33.69 45.55,29.62 45.55,26.14 arc45 LED-ER3:U$6.P12
LED-ER4:B0
  Top 0.305: LED-ER4:TLC1.5 33.76,49.05 33.76,48.73 | 28.98,14.97 28.98,13.18 arc-45 28.91,13 LED-ER4:U$6.P5
  Top 0.406: 33.76,48.73 33.76,22.72 arc-45 33.69,22.54 28.98,17.84 28.98,14.97
LED-ER4:B1
  Top 0.305: LED-ER4:TLC1.8 36.63,50.99 36.63,50.68
  Top 0.406: 36.63,50.68 36.63,14.12 arc-45 36.55,13.94 34.4,11.79 LED-ER4:U$6.P1 arc-45 LED-ER4:U$6.P1
LED-ER4:B2
  Top 0.305: LED-ER4:TLC1.15 15.61,49.7 15.61,49.38 | 18.79,14.97 18.79,13.15 arc-45 18.72,12.97 LED-ER4:U$6.P13
  Top 0.406: 15.61,49.38 15.61,18.47 18.79,15.29 18.79,14.97
LED-ER4:B3
  Top 0.305: LED-ER4:TLC1.18 18.47,47.74 18.47,47.43 | 23.89,14.97 23.89,13.16 arc-45 23.81,12.98 LED-ER4:U$6.P9
  Top 0.406: 18.47,47.43 18.47,22.08 18.47,21.98 23.89,16.56 23.89,14.97
LED-ER4:G0
  Top 0.305: LED-ER4:TLC1.4 32.81,48.4 32.81,48.08
  Top 0.406: 32.81,48.08 32.81,23.68 arc-45 32.73,23.5 27.71,18.47 27.71,14.36 arc-45 LED-ER4:U$6.P6
LED-ER4:G1
  Top 0.305: LED-ER4:TLC1.7 35.67,50.34 35.67,50.03
  Top 0.406: 35.67,50.03 35.67,19.22 arc-45 35.6,19.04 32.81,16.24 32.81,14.4 arc-45 LED-ER4:U$6.P2
LED-ER4:G2
  Top 0.305: LED-ER4:TLC1.14 14.65,50.34 14.65,50.03
  Top 0.406: 14.65,50.03 14.65,17.22 LED-ER4:U$6.P14
LED-ER4:G3
  Top 0.305: LED-ER4:TLC1.17 17.52,48.4 17.52,48.08
  Top 0.406: 17.52,48.08 17.52,21.02 22.61,15.93 LED-ER4:U$6.P10
LED-ER4:IREF
  Top 0.254: LED-ER4:TLC1.1 28.67,46.45 | 23.89,45.55 LED-ER4:R3.1
  Top 0.305: 28.67,46.45 28.66,46.45 28.66,46.25
  Top 0.406: 23.89,45.55 28.67,45.55 28.67,46.25 28.66,46.25 | LED-ER4:R6.1 23.89,33.33 LED-ER4:R3.1
LED-ER4:R0
  Top 0.305: LED-ER4:TLC1.3 31.85,47.74 31.85,47.43
  Top 0.406: 31.85,47.43 31.85,24.95 arc-45 31.78,24.77 25.16,18.16 LED-ER4:U$6.P8 arc-45 LED-ER4:U$6.P8
LED-ER4:R1
  Top 0.305: LED-ER4:TLC1.6 34.72,49.7 34.72,49.38
  Top 0.406: 34.72,49.38 34.72,21.45 arc-45 34.64,21.27 30.26,16.88 30.26,14.38 arc-45 LED-ER4:U$6.P4
LED-ER4:R2
  Top 0.305: LED-ER4:TLC1.13 13.7,50.99 13.7,50.33
  Top 0.406: 13.7,50.36 13.7,50.33 13.7,15.74 arc45 13.77,15.56 LED-ER4:U$6.P16
LED-ER4:R3
  Top 0.305: LED-ER4:TLC1.16 16.56,49.05 16.56,48.73
  Top 0.406: 16.56,48.73 16.56,19.54 16.56,19.43 20.07,15.93 20.07,14.34 LED-ER4:U$6.P12
N$1
  Top 0.305: R2.2
  Top 0.61: LED1.K R2.2
N$2
  Top 0.305: LED-ER2:TLC1.10 LED-ER1:TLC1.11 | LED-ER1:TLC1.11
N$3
  Top 0.305: LED-ER2:TLC1.9 LED-ER1:TLC1.12 | LED-ER1:TLC1.12
N$4
  Top 0.305: LED-ER2:TLC1.11 LED-ER3:TLC1.10
N$5
  Top 0.305: LED-ER3:TLC1.9 LED-ER2:TLC1.12
N$6
  Top 0.305: LED-ER3:TLC1.11 LED-ER4:TLC1.10
N$7
  Top 0.305: LED-ER4:TLC1.9 LED-ER3:TLC1.12
N$8
  Top 0.305: JP_SIGOUT.1 16.12,52.3 LED-ER4:TLC1.11
N$9
  Top 0.305: LED-ER4:TLC1.12 13.58,51.65 JP_SIGOUT.2
N$54
  Top 0.305: JP_PROG.1 115.17,38.84 118.4,35.61 118.4,33.91 U$5.GND2
N$55
  Top 0.305: JP_PROG.2 111.65,34.77 115.42,31.32 U$5.PROG
VIN
  Top 0.813: 118.49,4.14 115.94,4.14 +V_LED.1 | JP_15VIN.2 135.12,5.56 135.12,6.52 | 135.13,9.3 135.13,11.5 C4.+ | 118.49,4.15 123.88,4.15 arc-45 123.9,4.14
  Top 1.016: 127.41,4.14 135.1,4.14 arc45 JP_15VIN.2
  Top 1.422: 118.49,4.15 118.49,4.14 | 135.12,6.52 135.12,9.3 135.13,9.3
  Top 2.184: 123.9,4.14 127.41,4.14
  pour Top (isolate 0.406): 87.59,24.53 111.48,24.53 111.8,8.28 124.54,8.28 124.54,0.32 12.74,0.32 12.74,12.42 38.86,12.42 38.86,23.89 60.84,23.89 60.84,12.1 87.59,11.79
  pour Top (isolate 0.406): 126.45,0.32 151.61,0.32 151.61,22.3 150.66,23.25 136.64,23.25 126.45,13.38

### Text on the board
tPlace: DO | CO | CIN | DIN | +5V | PROG | r | g | r | g | r | g | r | g | 3 | 1 | V+ | b | V+ | b | V+ | b | V+ | b | 3 | 4 | 1 | 2 | +5V | 4 | 2 | GND | V+